# Altium schematic sheet main.SchDoc
size A3; Author: DAKZ; SheetNumber: 1; SheetTotal: 3